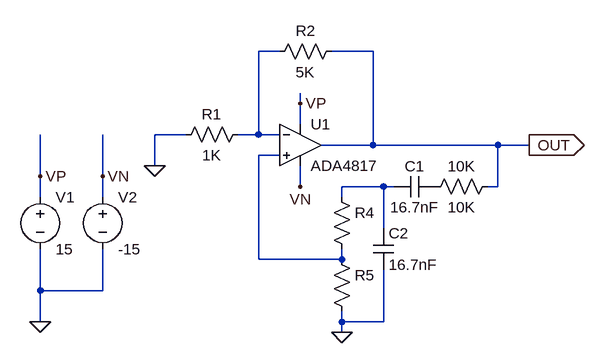
[diagram p0: schematic hihanten.asc]
hihanten.asc, the LTspice schematic file:
Version 4
SHEET 1 940 832
WIRE 400 288 368 288
WIRE 544 288 480 288
WIRE 432 368 432 352
WIRE 432 400 432 368
WIRE 256 416 208 416
WIRE 368 416 368 288
WIRE 368 416 336 416
WIRE 400 416 368 416
WIRE 544 432 544 288
WIRE 544 432 464 432
WIRE 736 432 544 432
WIRE 784 432 736 432
WIRE 400 448 368 448
WIRE 208 464 208 416
WIRE 32 480 32 416
WIRE 128 480 128 416
WIRE 432 496 432 464
WIRE 560 496 496 496
WIRE 576 496 560 496
WIRE 736 496 736 432
WIRE 736 496 720 496
WIRE 32 512 32 480
WIRE 128 512 128 480
WIRE 496 512 496 496
WIRE 560 560 560 496
WIRE 368 608 368 448
WIRE 496 608 496 592
WIRE 496 608 368 608
WIRE 32 656 32 592
WIRE 128 656 128 592
WIRE 128 656 32 656
WIRE 32 704 32 656
WIRE 496 704 496 688
WIRE 560 704 560 624
WIRE 560 704 496 704
WIRE 496 720 496 704
FLAG 208 464 0
FLAG 32 480 VP
FLAG 432 368 VP
FLAG 432 496 VN
FLAG 128 480 VN
FLAG 32 704 0
FLAG 784 432 OUT
IOPIN 784 432 Out
FLAG 496 720 0
SYMBOL OpAmps/ADA4817 432 368 R0
SYMATTR InstName U1
SYMBOL voltage 32 496 R0
SYMATTR InstName V1
SYMATTR Value 15
SYMBOL voltage 128 496 R0
SYMATTR InstName V2
SYMATTR Value -15
SYMBOL res 352 400 R90
WINDOW 0 0 56 VBottom 2
WINDOW 3 32 56 VTop 2
SYMATTR InstName R1
SYMATTR Value 1K
SYMBOL res 496 272 R90
WINDOW 0 0 56 VBottom 2
WINDOW 3 32 56 VTop 2
SYMATTR InstName R2
SYMATTR Value 5K
SYMBOL res 736 480 R90
WINDOW 0 0 56 VBottom 2
WINDOW 3 32 56 VTop 2
SYMATTR InstName 10K
SYMATTR Value 10K
SYMBOL cap 640 480 R90
WINDOW 0 0 32 VBottom 2
WINDOW 3 32 32 VTop 2
SYMATTR InstName C1
SYMATTR Value 16.7nF
SYMBOL res 480 496 R0
SYMATTR InstName R4
SYMATTR Value ""
SYMBOL res 480 592 R0
SYMATTR InstName R5
SYMATTR Value ""
SYMBOL cap 544 560 R0
SYMATTR InstName C2
SYMATTR Value 16.7nF

The netlist it stands for:
* hihanten.asc
XU1 N002 N001 VP VN OUT ADA4817  ; pins In+ In- V+ V- OUT
V1 VP 0 15
V2 VN 0 -15
R1 N001 0 1K
R2 OUT N001 5K
R§10K OUT P001 10K
C1 P001 N003 16.7nF
R4 N003 N002
R5 N002 0
C2 N003 0 16.7nF
.backanno
.end